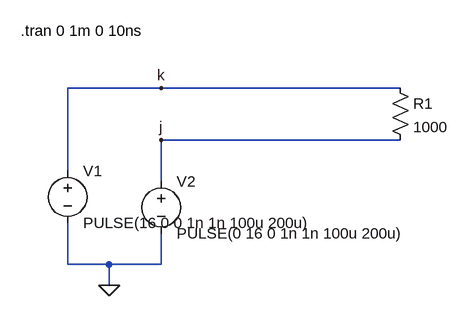
[diagram p0: schematic Draft1.asc]
Draft1.asc, the LTspice schematic file:
Version 4
SHEET 1 880 680
WIRE 208 144 64 144
WIRE 576 144 208 144
WIRE 576 224 208 224
WIRE 64 272 64 144
WIRE 208 288 208 224
WIRE 64 416 64 352
WIRE 128 416 64 416
WIRE 208 416 208 368
WIRE 208 416 128 416
WIRE 128 448 128 416
FLAG 128 448 0
FLAG 208 224 j
FLAG 208 144 k
SYMBOL voltage 208 272 R0
SYMATTR InstName V2
SYMATTR Value PULSE(0 16 0 1n 1n 100u 200u)
SYMBOL res 560 128 R0
SYMATTR InstName R1
SYMATTR Value 1000
SYMBOL voltage 64 256 R0
SYMATTR InstName V1
SYMATTR Value PULSE(16 0 0 1n 1n 100u 200u)
TEXT -8 56 Left 2 !.tran 0 1m 0 10ns

The netlist it stands for:
* Draft1.asc
V2 j 0 PULSE(0 16 0 1n 1n 100u 200u)
R1 k j 1000
V1 k 0 PULSE(16 0 0 1n 1n 100u 200u)
.tran 0 1m 0 10ns
.backanno
.end